# EAGLE schematic main_node (EAGLE 9.6.2)

## Sheet 1 of 2
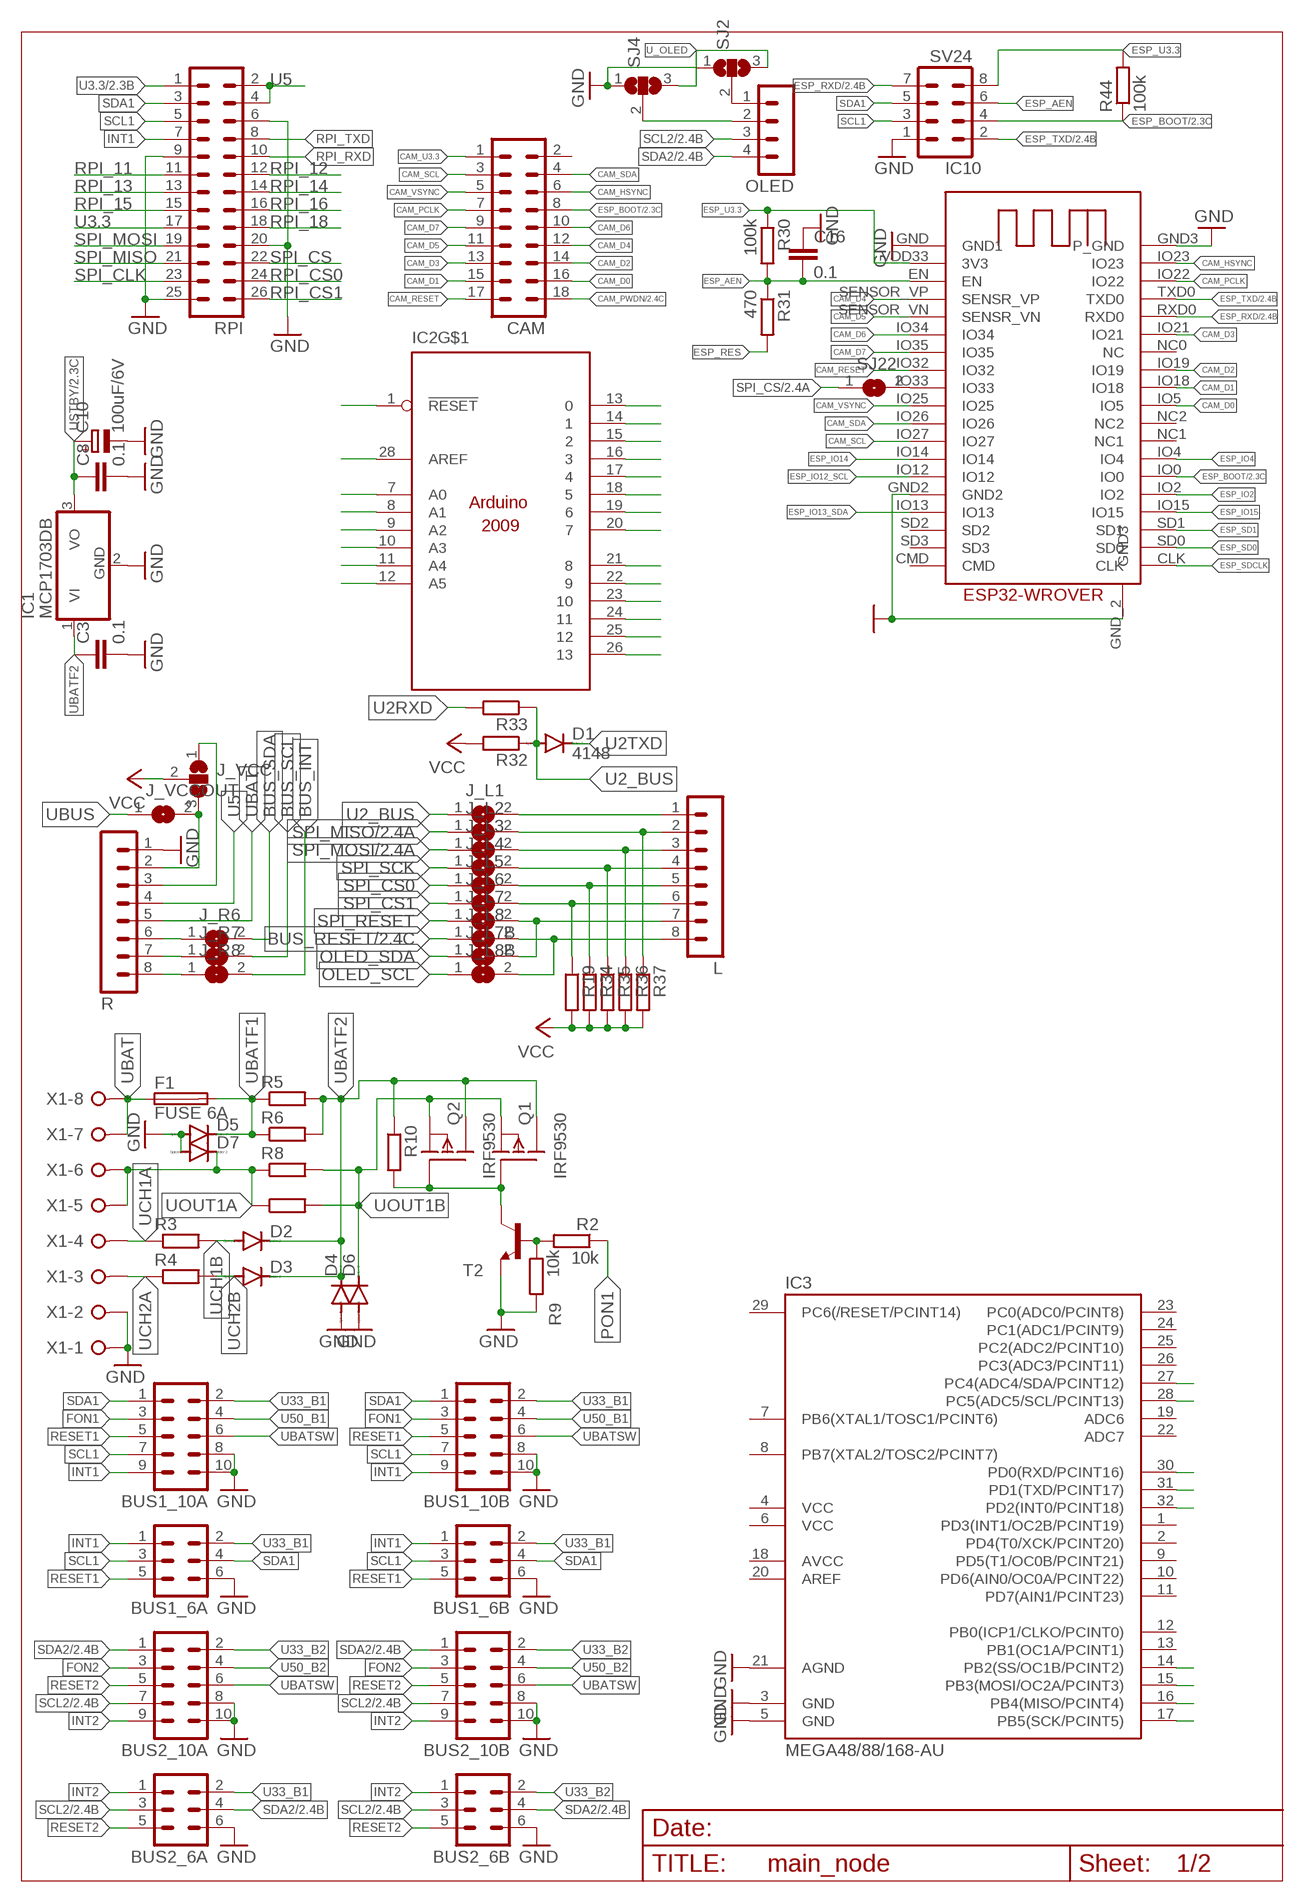
[diagram p0: schematic, sheet 1]

### Parts
BUS1_6A  ML6  [ML6]
BUS1_6B  ML6  [ML6]
BUS1_10A  ML10  [ML10]
BUS1_10B  ML10  [ML10]
BUS2_6A  ML6  [ML6]
BUS2_6B  ML6  [ML6]
BUS2_10A  ML10  [ML10]
BUS2_10B  ML10  [ML10]
C3  0.1  C-EUC0805  [C0805]
C8  0.1  C-EUC0805  [C0805]
C10  100uF/6V  CPOL-EUB/3528-21R  [B/3528-21R]
C16  0.1  C-EUC0805  [C0805]
CAM  MA09-2  [MA09-2]
D1  4148  DIODE-MINIMELF  [MINIMELF]
D2  DIODE-MELF-MLL41  [MELF-MLL41]
D3  DIODE-MELF-MLL41  [MELF-MLL41]
D4  DIODE-MELF-MLL41  [MELF-MLL41]
D5  DIODE-MELF-MLL41  [MELF-MLL41]
D6  DIODE-MELF-MLL41  [MELF-MLL41]
D7  DIODE-MELF-MLL41  [MELF-MLL41]
F1  FUSE 6A  FUSESH22,5A  [SH22,5A]
IC1  MCP1703DB  [SOT223]
IC2  ARDUINO2009_22  [ARDUINO2009_2]
IC3  MEGA48/88/168-AU  [TQFP32-08]
IC10  ESP32-WROVER  [ESP32-WROVER]
J_L1  SJ  [SJ]
J_L2  SJ  [SJ]
J_L3  SJ  [SJ]
J_L4  SJ  [SJ]
J_L5  SJ  [SJ]
J_L6  SJ  [SJ]
J_L7  SJ  [SJ]
J_L7B  SJ  [SJ]
J_L8  SJ  [SJ]
J_L8B  SJ  [SJ]
J_R6  SJ  [SJ]
J_R7  SJ  [SJ]
J_R8  SJ  [SJ]
J_VCC  SJ2W  [SJ_2]
J_VCCOUT  SJ  [SJ]
L  MA08-1  [MA08-1]
OLED  MA04-1  [MA04-1]
Q1  IRF9530  [TO220]
Q2  IRF9530  [TO220]
R  MA08-1  [MA08-1]
R2  10k  R-EU_R0805  [R0805]
R3  R-EU_R2512  [R2512]
R4  R-EU_R2512  [R2512]
R5  R-EU_R2512  [R2512]
R6  R-EU_R2512  [R2512]
R7  R-EU_R2512  [R2512]
R8  R-EU_R2512  [R2512]
R9  10k  R-EU_R0805  [R0805]
R10  R-EU_R0805  [R0805]
R19  R-EU_R0805  [R0805]
R30  100k  R-EU_R0805  [R0805]
R31  470  R-EU_R0805  [R0805]
R32  R-EU_R0805  [R0805]
R33  R-EU_R0805  [R0805]
R34  R-EU_R0805  [R0805]
R35  R-EU_R0805  [R0805]
R36  R-EU_R0805  [R0805]
R37  R-EU_R0805  [R0805]
R44  100k  R-EU_R0805  [R0805]
RPI  MA13-2  [MA13-2]
SJ2  SJ2W  [SJ_2]
SJ4  SJ2W  [SJ_2]
SJ22  SJ  [SJ]
SV24  MA04-2  [MA04-2]
T2  BC817-16-NPN-SOT23-BEC  [SOT23-BEC]
X1  W237-08P  [W237-8P]

### Nets
BUS_INT: J_R8.2
BUS_RESET: J_L8.1 ; also sheet 2
BUS_SCL: J_R7.2
BUS_SDA: J_R6.2
CAM_D0: CAM.16 IC10.IO5
CAM_D1: CAM.15 IC10.IO18
CAM_D2: CAM.14 IC10.IO19
CAM_D3: CAM.13 IC10.IO21
CAM_D4: CAM.12 IC10.SENSOR_VP(SENSR_VP)
CAM_D5: CAM.11 IC10.SENSOR_VN(SENSR_VN)
CAM_D6: CAM.10 IC10.IO34
CAM_D7: CAM.9 IC10.IO35
CAM_HSYNC: CAM.6 IC10.IO23
CAM_PCLK: CAM.7 IC10.IO22
CAM_PWDN: CAM.18 ; also sheet 2
CAM_RESET: CAM.17 IC10.IO32
CAM_SCL: CAM.3 IC10.IO27
CAM_SDA: CAM.4 IC10.IO26
CAM_U3.3: CAM.1
CAM_VSYNC: CAM.5 IC10.IO25
ESP_AEN: C16.2 IC10.EN R30.2 R31.1 SV24.6
ESP_BOOT: CAM.8 IC10.IO0 R44.1 SV24.4 ; also sheet 2
ESP_IO2: IC10.IO2
ESP_IO4: IC10.IO4
ESP_IO12_SCL: IC10.IO12
ESP_IO13_SDA: IC10.IO13
ESP_IO14: IC10.IO14
ESP_IO15: IC10.IO15
ESP_RES: R31.2
ESP_RXD: IC10.RXD0 SV24.7 ; also sheet 2
ESP_SD0: IC10.SD0
ESP_SD1: IC10.SD1
ESP_SDCLK: IC10.CLK
ESP_TXD: IC10.TXD0 SV24.2 ; also sheet 2
ESP_U3.3 [power]: IC10.VDD33(3V3) R30.1 R44.2 SV24.8
FON1: BUS1_10A.3 BUS1_10B.3
FON2: BUS2_10A.3 BUS2_10B.3
GND [gnd]: BUS1_6A.6 BUS1_6B.6 BUS1_10A.8 BUS1_10A.10 BUS1_10B.8 BUS1_10B.10 BUS2_6A.6 BUS2_6B.6 BUS2_10A.8 BUS2_10A.10 BUS2_10B.8 BUS2_10B.10 C3.2 C8.2 C10.- C16.1 D4.A D5.A D6.A D7.A IC1.2(GND) IC3.3(GND) IC3.5(GND) IC3.21(AGND) IC10.GND2 IC10.GND3(P_GND) IC10.GND(GND1) IC10.GND_2(GND3) R9.2 R.1 RPI.6 RPI.9 RPI.20 RPI.25 SJ2.1 SJ4.1 SV24.1 T2.E X1.1 X1.2 ; also sheet 2
INT1: BUS1_6A.1 BUS1_6B.1 BUS1_10A.9 BUS1_10B.9 RPI.7
INT2: BUS2_6A.1 BUS2_6B.1 BUS2_10A.9 BUS2_10B.9
LCD_1 [power]: OLED.1 SJ2.2
LCD_2 [power]: OLED.2 SJ4.2
N$1: Q1.1(G) Q2.1(G) R10.2 T2.C
N$2: IC3.28(PC5(ADC5/SCL/PCINT13))
N$3: IC3.27(PC4(ADC4/SDA/PCINT12))
N$4: IC3.14(PB2(SS/OC1B/PCINT2))
N$5: J_R6.1 R.6
N$6: J_R7.1 R.7
N$7: IC10.IO33 SJ22.2
N$8: IC2.7(A0)
N$9: IC2.8(A1)
N$10: IC2.9(A2)
N$11: IC2.10(A3)
N$12: J_R8.1 R.8
N$13: IC2.11(A4)
N$14: IC2.12(A5)
N$15: IC2.13
N$16: IC2.14
N$17: IC2.15
N$18: IC2.16
N$19: IC2.17
N$20: IC2.18
N$21: IC2.19
N$22: IC2.20
N$23: IC2.21
N$24: J_L7.2 J_L7B.2 L.7
N$25: J_L6.2 L.6 R19.1
N$26: IC2.22
N$27: J_L8.2 J_L8B.2 L.8
N$28: J_L5.2 L.5 R34.1
N$29: J_L4.2 L.4 R35.1
N$30: J_L2.2 L.2 R37.1
N$31: J_L3.2 L.3 R36.1
N$32: J_L1.2 L.1
N$33: IC2.23
N$34: IC2.24
N$35: IC2.25
N$36: IC2.26
N$37: IC2.28(AREF)
N$38: IC2.1(!RESET)
N$46: IC3.17(PB5(SCK/PCINT5))
N$47: IC3.16(PB4(MISO/PCINT4))
N$48: IC3.15(PB3(MOSI/OC2A/PCINT3))
N$49: IC3.31(PD1(TXD/PCINT17))
N$50: IC3.30(PD0(RXD/PCINT16))
N$51: R2.2 R9.1 T2.B
N$52: IC3.32(PD2(INT0/PCINT18))
OLED_SCL: J_L8B.1
OLED_SDA: J_L7B.1
PON1: R2.1
RESET1: BUS1_6A.5 BUS1_6B.5 BUS1_10A.5 BUS1_10B.5
RESET2: BUS2_6A.5 BUS2_6B.5 BUS2_10A.5 BUS2_10B.5
RPI_11: RPI.11 ; also sheet 2
RPI_12: RPI.12 ; also sheet 2
RPI_13: RPI.13 ; also sheet 2
RPI_14: RPI.14 ; also sheet 2
RPI_15: RPI.15 ; also sheet 2
RPI_16: RPI.16 ; also sheet 2
RPI_18: RPI.18 ; also sheet 2
RPI_CS0: RPI.24 ; also sheet 2
RPI_CS1: RPI.26 ; also sheet 2
RPI_RXD: RPI.10
RPI_TXD: RPI.8
SCL1: BUS1_6A.3 BUS1_6B.3 BUS1_10A.7 BUS1_10B.7 RPI.5 SV24.3
SCL2: BUS2_6A.3 BUS2_6B.3 BUS2_10A.7 BUS2_10B.7 OLED.3 ; also sheet 2
SDA1: BUS1_6A.4 BUS1_6B.4 BUS1_10A.1 BUS1_10B.1 RPI.3 SV24.5
SDA2: BUS2_6A.4 BUS2_6B.4 BUS2_10A.1 BUS2_10B.1 OLED.4 ; also sheet 2
SPI_CLK: RPI.23 ; also sheet 2
SPI_CS: RPI.22 SJ22.1 ; also sheet 2
SPI_CS0: J_L5.1
SPI_CS1: J_L6.1
SPI_MISO: J_L2.1 RPI.21 ; also sheet 2
SPI_MOSI: J_L3.1 RPI.19 ; also sheet 2
SPI_RESET: J_L7.1
SPI_SCK: J_L4.1
U2_BUS: D1.A J_L1.1 R32.1 R33.1
U2RXD: R33.2
U2TXD: D1.C
U3.3 [power]: RPI.1 RPI.17 ; also sheet 2
U5 [power]: R.4 RPI.2 RPI.4
U33_B1 [power]: BUS1_6A.2 BUS1_6B.2 BUS1_10A.2 BUS1_10B.2 BUS2_6A.2
U33_B2 [power]: BUS2_6B.2 BUS2_10A.2 BUS2_10B.2
U33A [power]: J_VCC.3 J_VCCOUT.2 R.2
U33B [power]: J_VCC.1 R.3
U50_B1 [power]: BUS1_10A.4 BUS1_10B.4
U50_B2 [power]: BUS2_10A.4 BUS2_10B.4
U_OLED [power]: SJ2.3 SJ4.3
UBAT [power]: F1.1 R.5 X1.7 X1.8
UBATF1: D5.C F1.2 R5.1 R6.1
UBATF2: C3.1 D2.C D3.C D4.C IC1.1(VI) Q1.2(D) Q2.2(D) R5.2 R6.2 R10.1
UBATSW [power]: BUS1_10A.6 BUS1_10B.6 BUS2_10A.6 BUS2_10B.6
UBUS [power]: J_VCCOUT.1
UCH1A: R3.1 X1.4
UCH1B: D2.A R3.2
UCH2A: R4.1 X1.3
UCH2B: D3.A R4.2
UOUT1A: D7.C R7.1 R8.1 X1.5 X1.6
UOUT1B: D6.C Q1.3(S) Q2.3(S) R7.2 R8.2
USTBY: C8.1 C10.+ IC1.3(VO) ; also sheet 2
VCC [power]: J_VCC.2 R19.2 R32.2 R34.2 R35.2 R36.2 R37.2
Unconnected: CAM.2 IC3.1(PD3(INT1/OC2B/PCINT19)) IC3.2(PD4(T0/XCK/PCINT20)) IC3.7(PB6(XTAL1/TOSC1/PCINT6)) IC3.8(PB7(XTAL2/TOSC2/PCINT7)) IC3.9(PD5(T1/OC0B/PCINT21)) IC3.10(PD6(AIN0/OC0A/PCINT22)) IC3.11(PD7(AIN1/PCINT23)) IC3.12(PB0(ICP1/CLKO/PCINT0)) IC3.13(PB1(OC1A/PCINT1)) IC3.18(AVCC) IC3.19(ADC6) IC3.20(AREF) IC3.22(ADC7) IC3.23(PC0(ADC0/PCINT8)) IC3.24(PC1(ADC1/PCINT9)) IC3.25(PC2(ADC2/PCINT10)) IC3.26(PC3(ADC3/PCINT11)) IC3.29(PC6(/RESET/PCINT14)) IC10.CMD IC10.NC0(NC) IC10.NC1 IC10.NC2 IC10.SD2 IC10.SD3

## Sheet 2 of 2
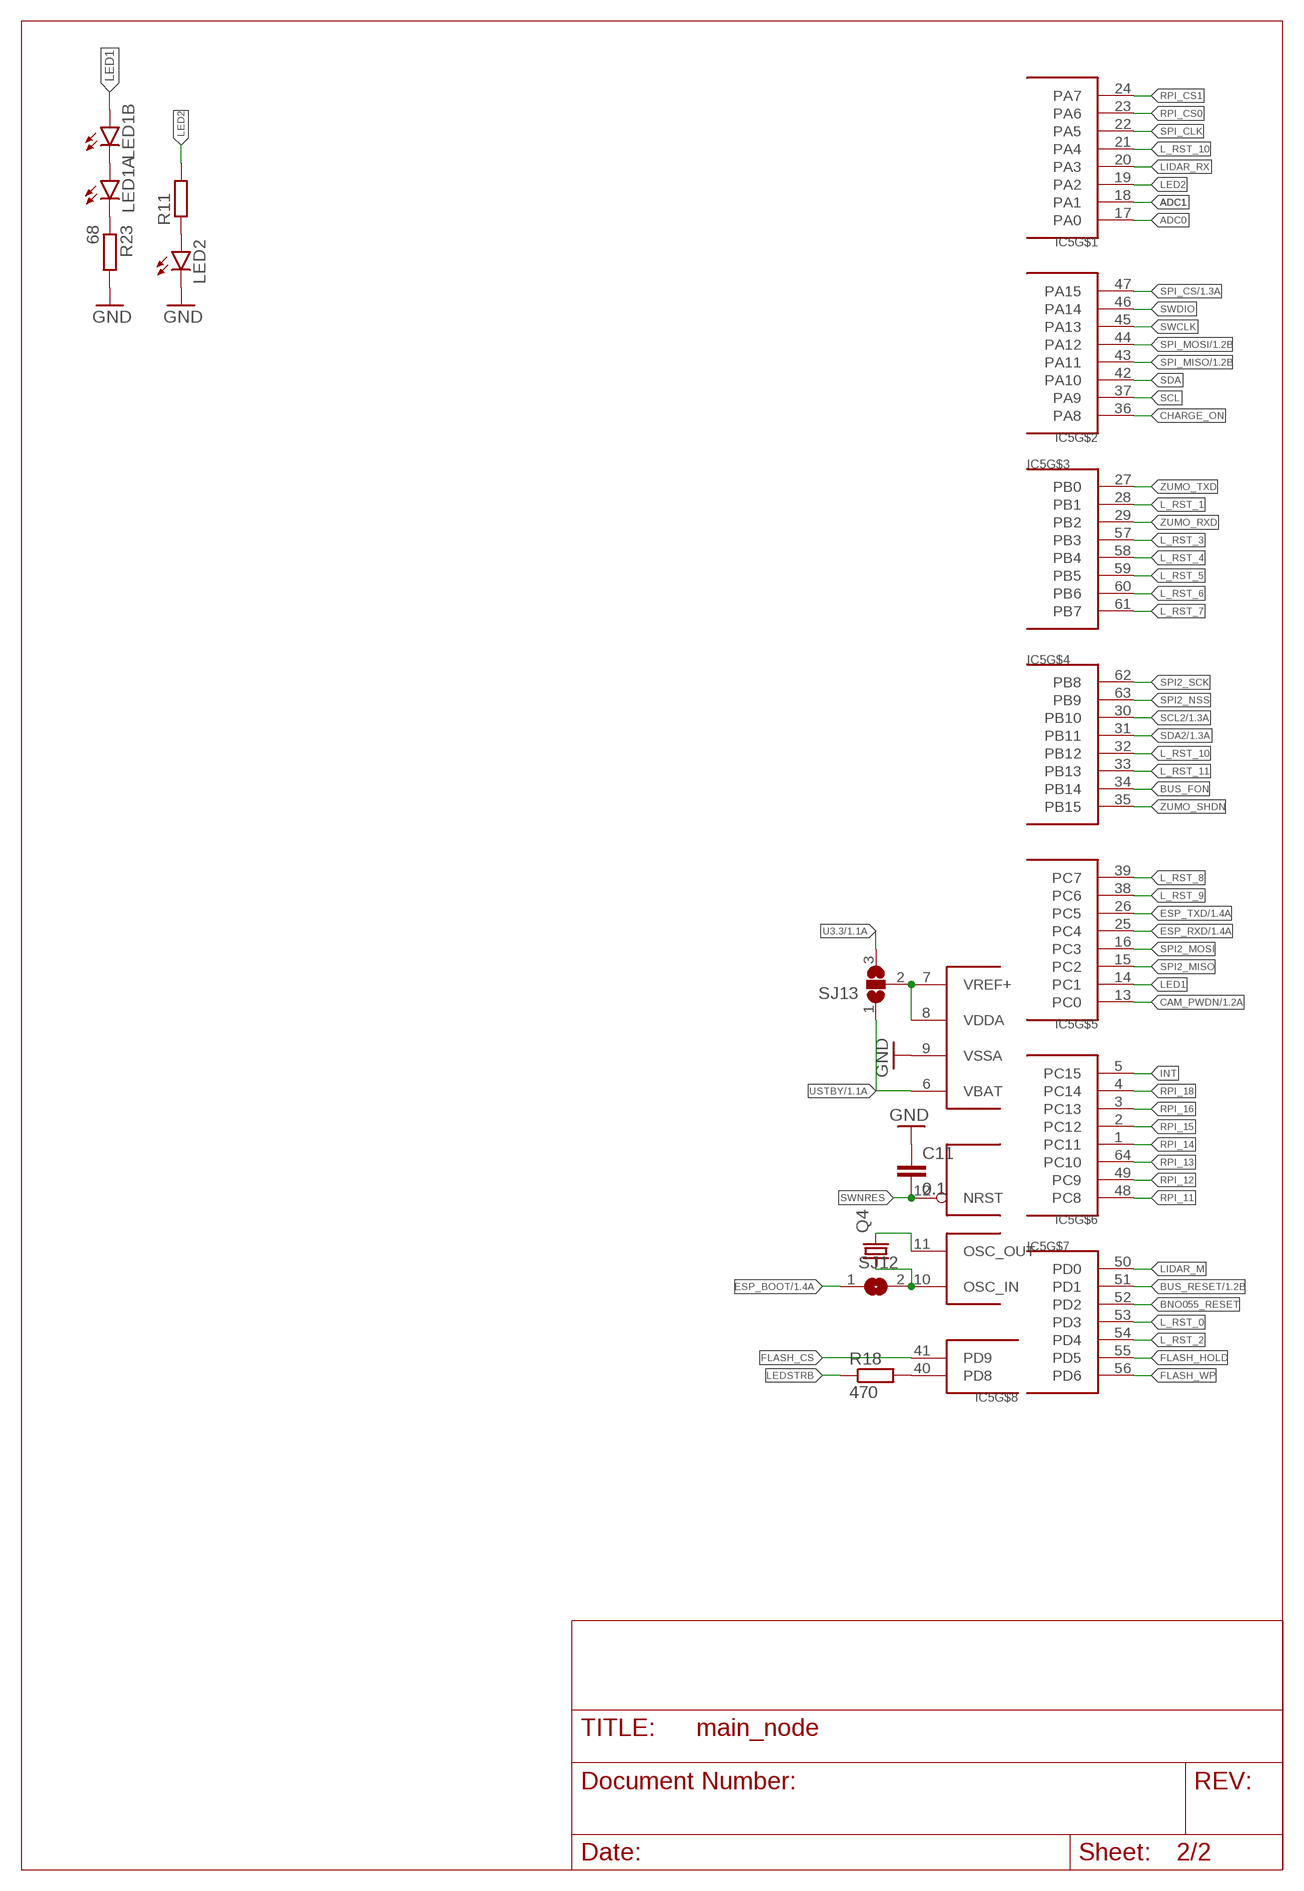
[diagram p1: schematic, sheet 2]

### Parts
C11  0.1  C-EUC0805  [C0805]
IC5  STM32G081RBT6  [TQFP64]
LED1A  LED5MM  [LED5MM]
LED1B  LED5MM  [LED5MM]
LED2  LEDCHIPLED_0805  [CHIPLED_0805]
Q4  CRYSTALTC26V  [TC26V]
R11  R-EU_R0603  [R0603]
R18  470  R-EU_R0805  [R0805]
R23  68  R-EU_R0805  [R0805]
SJ12  SJ  [SJ]
SJ13  SJ2W  [SJ_2]

### Nets
ADC0: IC5.17(PA0)
ADC1: IC5.18(PA1)
BNO055_RESET: IC5.52(PD2)
BUS_FON: IC5.34(PB14)
BUS_RESET: IC5.51(PD1) ; also sheet 1
CAM_PWDN: IC5.13(PC0) ; also sheet 1
CHARGE_ON: IC5.36(PA8)
ESP_BOOT: SJ12.1 ; also sheet 1
ESP_RXD: IC5.25(PC4) ; also sheet 1
ESP_TXD: IC5.26(PC5) ; also sheet 1
FLASH_CS: IC5.41(PD9)
FLASH_HOLD: IC5.55(PD5)
FLASH_WP: IC5.56(PD6)
GND [gnd]: C11.1 IC5.9(VSSA) LED2.C R23.2 ; also sheet 1
INT: IC5.5(PC15)
L_RST_0: IC5.53(PD3)
L_RST_1: IC5.28(PB1)
L_RST_2: IC5.54(PD4)
L_RST_3: IC5.57(PB3)
L_RST_4: IC5.58(PB4)
L_RST_5: IC5.59(PB5)
L_RST_6: IC5.60(PB6)
L_RST_7: IC5.61(PB7)
L_RST_8: IC5.39(PC7)
L_RST_9: IC5.38(PC6)
L_RST_10: IC5.21(PA4) IC5.32(PB12)
L_RST_11: IC5.33(PB13)
LED1: IC5.14(PC1) LED1B.A
LED2: IC5.19(PA2) R11.2
LEDSTRB: R18.1
LIDAR_M: IC5.50(PD0)
LIDAR_RX: IC5.20(PA3)
N$39: IC5.10(OSC_IN) Q4.1 SJ12.2
N$40 [power]: IC5.7(VREF+) IC5.8(VDDA) SJ13.2
N$41: IC5.40(PD8) R18.2
N$42: LED1A.A LED1B.K(C)
N$43: LED1A.K(C) R23.1
N$44: IC5.11(OSC_OUT) Q4.2
N$45: LED2.A R11.1
RPI_11: IC5.48(PC8) ; also sheet 1
RPI_12: IC5.49(PC9) ; also sheet 1
RPI_13: IC5.64(PC10) ; also sheet 1
RPI_14: IC5.1(PC11) ; also sheet 1
RPI_15: IC5.2(PC12) ; also sheet 1
RPI_16: IC5.3(PC13) ; also sheet 1
RPI_18: IC5.4(PC14) ; also sheet 1
RPI_CS0: IC5.23(PA6) ; also sheet 1
RPI_CS1: IC5.24(PA7) ; also sheet 1
SCL: IC5.37(PA9)
SCL2: IC5.30(PB10) ; also sheet 1
SDA: IC5.42(PA10)
SDA2: IC5.31(PB11) ; also sheet 1
SPI2_MISO: IC5.15(PC2)
SPI2_MOSI: IC5.16(PC3)
SPI2_NSS: IC5.63(PB9)
SPI2_SCK: IC5.62(PB8)
SPI_CLK: IC5.22(PA5) ; also sheet 1
SPI_CS: IC5.47(PA15) ; also sheet 1
SPI_MISO: IC5.43(PA11) ; also sheet 1
SPI_MOSI: IC5.44(PA12) ; also sheet 1
SWCLK: IC5.45(PA13)
SWDIO: IC5.46(PA14)
SWNRES: C11.2 IC5.12(NRST)
U3.3 [power]: SJ13.3 ; also sheet 1
USTBY: IC5.6(VBAT) SJ13.1 ; also sheet 1
ZUMO_RXD: IC5.29(PB2)
ZUMO_SHDN: IC5.35(PB15)
ZUMO_TXD: IC5.27(PB0)

## Power pins joined to a net without a drawn wire
+3V3: IC2.2(+3V3)
+5V: IC2.3(+5V)
+VIN: IC2.6(+VIN)
GND: IC2.4(GND) IC2.5(GND) IC2.27(GND)
VCC: IC3.4(VCC) IC3.6(VCC)

## Library data of the parts
BUS1_6A BUS1_6B BUS2_6A BUS2_6B = con-harting-ml:ML6: HARTING; OC_FARNELL: unknown; OC_NEWARK: unknown
BUS1_10A BUS1_10B BUS2_10A BUS2_10B = con-harting-ml:ML10: HARTING; OC_FARNELL: unknown; OC_NEWARK: unknown
C3 C8 C11 C16 = rcl:C-EU: CAPACITOR, European symbol
C10 = rcl:CPOL-EU: POLARIZED CAPACITOR, European symbol
CAM = con-lstb:MA09-2: PIN HEADER; OC_FARNELL: unknown; OC_NEWARK: unknown
D1-D7 = diode:DIODE-: DIODE
F1 = fuse:FUSE: Fuse; OC_FARNELL: unknown; OC_NEWARK: unknown
IC1 = linear:MCP1703: 250 mA, 16V, Low Quiescent Current LDO Regulator Source: http://ww1.microchip.com/downloads/en/DeviceDoc/22049b.pdf
IC2 = arduino:ARDUINO2009_2: The Arduino Duemilanove ("2009") is a microcontroller board based on the ATmega168 or ATmega328. - 14 digital input/output pins (of which 6 can be used as PWM outputs) - 6 analog inputs, a 16 MHz crystal oscillator - USB connection - power jack - ISP header - reset button It contains everything needed to support the microcontroller; simply connect it to a computer with a USB cable or power it with a AC-to-DC adapter or battery to get started http://arduino.cc/en/Main/ArduinoBoardDuemilanove
IC3 = avr-6:MEGA48/88/168
IC5 = stm32:STM32G081RBT6
IC10 = ESP32-Wrover:ESP32-WROVER
J_L1-J_L7 J_L7B J_L8 J_L8B J_R6-J_R8 J_VCCOUT SJ12 SJ22 = jumper:SJ: SMD solder JUMPER
J_VCC SJ2 SJ4 SJ13 = jumper:SJ2W: SMD solder JUMPER
L R = con-lstb:MA08-1: PIN HEADER; OC_FARNELL: unknown; OC_NEWARK: unknown
LED1A LED1B LED2 = led:LED: LED OSRAM: - CHIPLED LG R971, LG N971, LY N971, LG Q971, LY Q971, LO R971, LY R971 LH N974, LH R974 LS Q976, LO Q976, LY Q976 LO Q996 - Hyper CHIPLED LW Q18S LB Q993, LB Q99A, LB R99A - SideLED LS A670, LO A670, LY A670, LG A670, LP A670 LB A673, LV A673, LT A673, LW A673 LH A674 LY A675 LS A676, LA A676, LO A676, LY A676, LW A676 LS A679, LY A679, LG A679 - Hyper Micro SIDELED® LS Y876, LA Y876, LO Y876, LY Y876 LT Y87S - SmartLED LW L88C, LW L88S LB L89C, LB L89S, LG L890 LS L89K, LO L89K, LY L89K LS L896, LA L896, LO L896, LY L896 - TOPLED LS T670, LO T670, LY T670, LG T670, LP T670 LSG T670, LSP T670, LSY T670, LOP T670, LYG T670 LG T671, LOG T671, LSG T671 LB T673, LV T673, LT T673, LW T673 LH T674 LS T676, LA T676, LO T676, LY T676, LB T676, LH T676, LSB T676, LW T676 LB T67C, LV T67C, LT T67C, LS T67K, LO T67K, LY T67K, LW E67C LS E67B, LA E67B, LO E67B, LY E67B, LB E67C, LV E67C, LT E67C LW T67C LS T679, LY T679, LG T679 LS T770, LO T770, LY T770, LG T770, LP T770 LB T773, LV T773, LT T773, LW T773 LH T774 LS E675, LA E675, LY E675, LS T675 LS T776, LA T776, LO T776, LY T776, LB T776 LHGB T686 LT T68C, LB T68C - Hyper Mini TOPLED® LB M676 - Mini TOPLED Santana® LG M470 LS M47K, LO M47K, LY M47K Source: http://www.osram.convergy.de LUXEON: - LUMILED® LXK2-PW12-R00, LXK2-PW12-S00, LXK2-PW14-U00, LXK2-PW14-V00 LXK2-PM12-R00, LXK2-PM12-S00, LXK2-PM14-U00 LXK2-PE12-Q00, LXK2-PE12-R00, LXK2-PE12-S00, LXK2-PE14-T00, LXK2-PE14-U00 LXK2-PB12-K00, LXK2-PB12-L00, LXK2-PB12-M00, LXK2-PB14-N00, LXK2-PB14-P00, LXK2-PB14-Q00 LXK2-PR12-L00, LXK2-PR12-M00, LXK2-PR14-Q00, LXK2-PR14-R00 LXK2-PD12-Q00, LXK2-PD12-R00, LXK2-PD12-S00 LXK2-PH12-R00, LXK2-PH12-S00 LXK2-PL12-P00, LXK2-PL12-Q00, LXK2-PL12-R00 Source: www.luxeon.com KINGBRIGHT: KA-3528ASYC Source: www.kingbright.com
OLED = con-lstb:MA04-1: PIN HEADER; OC_FARNELL: unknown; OC_NEWARK: unknown
Q1 Q2 = transistor-fet:IRF9530: P-Channel Enhancement MOSFET (HEXFET); -100V; -12A; 0,3Ohm
Q4 = crystal:CRYSTAL: CRYSTAL; OC_FARNELL: unknown; OC_NEWARK: unknown
R2 R9 R18 R23 R30 R31 R44 = rcl:R-EU_: RESISTOR, European symbol
R3-R8 R10 R11 R19 R32-R37 = rcl:R-EU_: RESISTOR, European symbol; SPICEPREFIX: R
RPI = con-lstb:MA13-2: PIN HEADER; OC_FARNELL: unknown; OC_NEWARK: unknown
SV24 = con-lstb:MA04-2: PIN HEADER; OC_FARNELL: unknown; OC_NEWARK: unknown
T2 = transistor:*-NPN-: NPN Transistror BF959 corrected 2008.03.06
X1 = con-wago-508:W237-08P: WAGO SREW CLAMP; OC_FARNELL: unknown; OC_NEWARK: unknown

## Net classes
1 gnd: width 0.381 mm, drill 0.381 mm
2 power: width 0.381 mm, drill 0.381 mm